# Altium schematic sheet LO 1.SchDoc
size A3; SheetNumber: 9; SheetTotal: 12
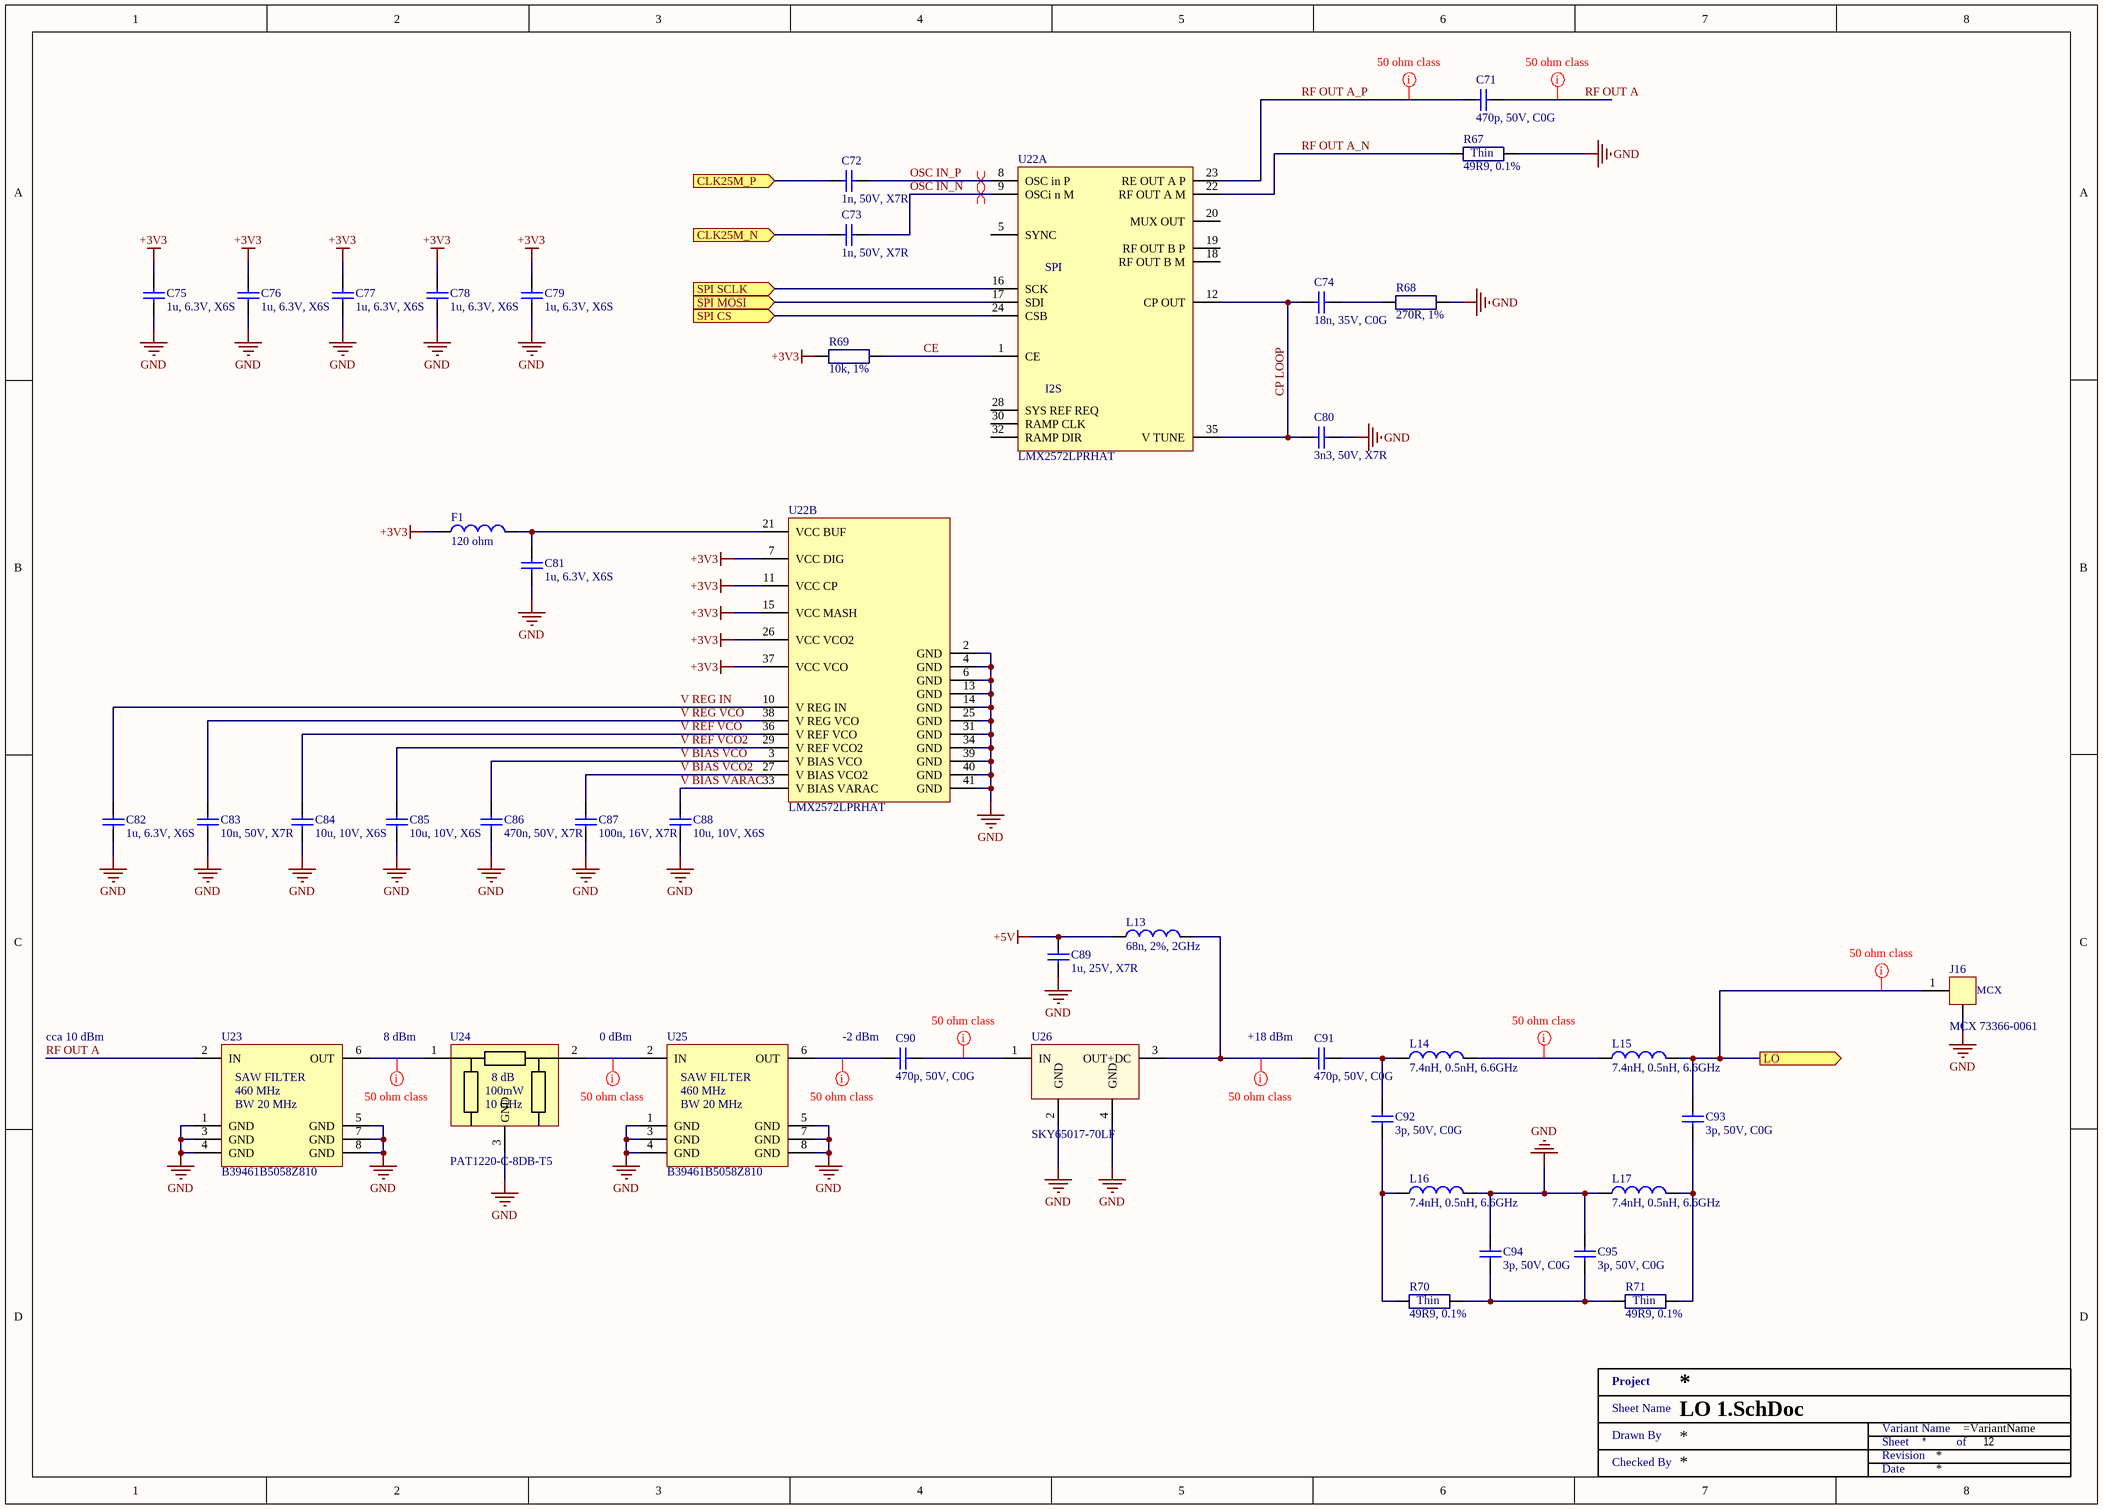
[diagram p0: LO 1.SchDoc]

## Parts
C71  470p, 50V, C0G  [SMD0603]
C72  1n, 50V, X7R  [SMD0402]
C73  1n, 50V, X7R  [SMD0402]
C74  18n, 35V, C0G  [SMD0603]
C75  1u, 6.3V, X6S  [SMD0402]
C76  1u, 6.3V, X6S  [SMD0402]
C77  1u, 6.3V, X6S  [SMD0402]
C78  1u, 6.3V, X6S  [SMD0402]
C79  1u, 6.3V, X6S  [SMD0402]
C80  3n3, 50V, X7R  [SMD0603]
C81  1u, 6.3V, X6S  [SMD0402]
C82  1u, 6.3V, X6S  [SMD0402]
C83  10n, 50V, X7R  [SMD0402]
C84  10u, 10V, X6S  [SMD0603]
C85  10u, 10V, X6S  [SMD0603]
C86  470n, 50V, X7R  [SMD0603]
C87  100n, 16V, X7R  [SMD0402]
C88  10u, 10V, X6S  [SMD0603]
C89  1u, 25V, X7R  [SMD0603]
C90  470p, 50V, C0G  [SMD0603]
C91  470p, 50V, C0G  [SMD0603]
C92  3p, 50V, C0G  [SMD0402]
C93  3p, 50V, C0G  [SMD0402]
C94  3p, 50V, C0G  [SMD0402]
C95  3p, 50V, C0G  [SMD0402]
F1  120 ohm  [SMD0805 - R]
J16  MCX 73366-0061  [73366-0061]
L13  68n, 2%, 2GHz  [SMD0603 - L]
L14  7.4nH, 0.5nH, 6.6GHz  [Coilcraft-0402DC]
L15  7.4nH, 0.5nH, 6.6GHz  [Coilcraft-0402DC]
L16  7.4nH, 0.5nH, 6.6GHz  [Coilcraft-0402DC]
L17  7.4nH, 0.5nH, 6.6GHz  [Coilcraft-0402DC]
R67  49R9, 0.1%  [SMD0402 - R]
R68  270R, 1%  [SMD0603 - R]
R69  10k, 1%  [SMD0603 - R]
R70  49R9, 0.1%  [SMD0402 - R]
R71  49R9, 0.1%  [SMD0402 - R]
U22  LMX2572LPRHAT  [VQFN50P600X600X100_HS-41N]  (parts A,B of 2)
U23  B39461B5058Z810  [QCC8B]
U24  PAT1220-C-8DB-T5  [PAT1220]
U25  B39461B5058Z810  [QCC8B]
U26  SKY65017-70LF  [SOT89]
XX?  Title 1  (value not drawn)  (graphical)

## Ports
CLK25M_N (in), CLK25M_P (in), LO (out), SPI CS (in), SPI MOSI (in), SPI SCLK (in)

## Nets
+3V3: C75.2 C76.2 C77.2 C78.2 C79.2 F1.1 R69.2 U22.7(VCC_DIG) U22.11(VCC_CP) U22.15(VCC_MASH) U22.26(VCC_VCO2) U22.37(VCC_VCO)
+5V: C89.2 L13.1
GND: C75.1 C76.1 C77.1 C78.1 C79.1 C80.1 C81.1 C82.1 C83.1 C84.1 C85.1 C86.1 C87.1 C88.1 C89.1 C94.2 C95.2 J16.2(GND) L16.2 L17.1 R67.2 R68.1 U22.2(GND) U22.4(GND) U22.6(GND) U22.13(GND) U22.14(GND) U22.25(GND) U22.31(GND) U22.34(GND) U22.39(GND) U22.40(GND) U22.41(GND) U23.1(GND) U23.3(GND) U23.4(GND) U23.5(GND) U23.7(GND) U23.8(GND) U24.3(GND) U25.1(GND) U25.3(GND) U25.4(GND) U25.5(GND) U25.7(GND) U25.8(GND) U26.2(GND) U26.4(GND)
CE: R69.1 U22.1(CE)
CLK25M_N: C73.1 ; port CLK25M_N
CLK25M_P: C72.1 ; port CLK25M_P
CP LOOP: C74.1 C80.2 U22.12(CP_OUT) U22.35(V_TUNE)
LO: C93.2 J16.1(INPUT) L15.2 ; port LO
OSC IN_N: C73.2 U22.9(OSCi_n_M)
OSC IN_P: C72.2 U22.8(OSC_in_P)
RF OUT A: C71.2 U23.2(IN)
RF OUT A_N: R67.1 U22.22(RF_OUT_A_M)
RF OUT A_P: C71.1 U22.23(RE_OUT_A_P)
SPI CS: U22.24(CSB) ; port SPI CS
SPI MOSI: U22.17(SDI) ; port SPI MOSI
SPI SCLK: U22.16(SCK) ; port SPI SCLK
V BIAS VARAC: C88.2 U22.33(V_BIAS_VARAC)
V BIAS VCO: C86.2 U22.3(V_BIAS_VCO)
V BIAS VCO2: C87.2 U22.27(V_BIAS_VCO2)
V REF VCO: C84.2 U22.36(V_REF_VCO)
V REF VCO2: C85.2 U22.29(V_REF_VCO2)
V REG IN: C82.2 U22.10(V_REG_IN)
V REG VCO: C83.2 U22.38(V_REG_VCO)
NetC74_2: C74.2 R68.2
NetC81_2: C81.2 F1.2 U22.21(VCC_BUF)
NetC90_1: C90.1 U25.6(OUT)
NetC90_2: C90.2 U26.1(IN)
NetC91_1: C91.1 L13.2 U26.3(OUT+DC)
NetC91_2: C91.2 C92.2 L14.1
NetC92_1: C92.1 L16.1 R70.1
NetC93_1: C93.1 L17.2 R71.2
NetC94_1: C94.1 C95.1 R70.2 R71.1
NetL14_2: L14.2 L15.1
NetU23_6: U23.6(OUT) U24.1
NetU24_2: U24.2 U25.2(IN)

Not connected (* = marked no-connect by the designer): U22 5(SYNC) 18(RF_OUT_B_M) 19(RF_OUT_B_P) 20(MUX_OUT) 28(SYS_REF_REQ) 30(RAMP_CLK) 32(RAMP_DIR)

## Layout directives
differential pair: OSC IN_N, OSC IN_P
net class 50 ohm: LO, NetC90_1, NetC90_2, NetC91_1, NetL14_2, NetU23_6, NetU24_2, RF OUT A, RF OUT A_P

## Notes on the sheet
- cca 10 dBm
- 8 dBm
- 0 dBm
- (near C90) -2 dBm
- (near C91) +18 dBm
- (in symbol AT0402BRD0749R9L) Thin
- (in symbol B39461B5058Z810) SAW FILTER; 460 MHz; BW 20 MHz
- (in symbol LMX2572LPRHAT, part A) SPI; I2S
- (in symbol PAT1220-C-8DB-T5) 8 dB; 10 GHz
- (in symbol Title 1) Project; Sheet Name; Variant Name; Drawn By; Sheet; of; Revision; Checked By; Date

## Library data of the parts
C71 C90 C91 = GCM1885C1H471JA16D: MURATA - GCM1885C1H471JA16D - CAP, MLCC, C0G/NP0, 470PF, 50V, 0603; Ceramic Capacitor Case: 0603 [1608 Metric]; Voltage Rating: 50; Capacitance Tolerance: ± 5%; Product Range: GCM Series; SVHC: No SVHC (17-Dec-2015)<!--FANDB--><div class="features-and-benefits-container"><div class="features-and-benefits-desc-container"><span class="features-and-benefits-container-desc">SMD Multilayer Ceramic Capacitor, 0603 [1608 Metric], 470 pF, 50 V, ± 5%, C0G / NP0, GCM Series</span></div><div class="features-and-benefits-description"><span class="features-benefits-value">The GCM series capacitors from Murata are automotive grade multilayer ceramic chip capacitors (MLCC) used for automotive applications such as power train and safety equipment. The safety equipment includes drive system control, air bags and ABS of engine ECU. These MLCC capacitors are classified into temperature compensating and high dielectric constant types depending on the change in electrostatic capacitance due to change in temperature. The temperature compensating capacitors feature a small rate of change in electrostatic capacitance as the temperature changes. The high dielectric constant capacitors use materials with a high dielectric constant and feature a large electrostatic capacitance.</span></div><div class="features-and-benefits-list"><ul class="features-and-benefits-list-list"><li class="features-and-benefits-list-item">Capacitance values ranges from 0.1pF to 47?F</li><li class="features-and-benefits-list-item">Large capacity and small size in a multilayer structure</li><li class="features-and-benefits-list-item">Tin plated external electrodes, excellent solderability</li><li class="features-and-benefits-list-item">Capacitor size varies from 0.6mm x 0.3mm to 5.7mm x 5.0mm</li><li class="features-and-benefits-list-item">Voltage rating ranges from 6.3VDC to 1000VDC</li><li class="features-and-benefits-list-item">Temperature characteristics are classified according to JIS and EIA standard</li><li class="features-and-benefits-list-item">Operating temperature changes according to temperature coefficient of capacitor</li><li class="features-and-benefits-list-item">Automotive grade AEC-Q200 qualified</li></ul></div><div class="features-and-benefits-applications"><ul class="features-and-benefits-value"><li class="features-and-benefits-list-item">Industrial</li><li class="features-and-benefits-list-item">Consumer Electronics</li><li class="features-and-benefits-list-item">Portable Devices</li><li class="features-and-benefits-list-item">Power Management</li><li class="features-and-benefits-list-item">Safety</li><li class="features-and-benefits-list-item">Automotive</li></ul></div></div>; Supplier 1: Farnell; Supplier Part Number 1: 2494192; Manufacturer: MURATA; Manufacturer Part Number: GCM1885C1H471JA16D; RoHS: YES; Stock 1: 10240; Pricing 1: 10=0.0277, 100=0.0184, 500=0.0139, 1000=0.0111, 2000=0.0103, 4000=0.0091, 20000=0.0077, 40000=0.0071 (GBP); Capacitance: 470p; Dielectric Characteristic: C0G / NP0; Packaging: Cut Tape; Operating Temperature Min: -55; Operating Temperature Max: 125; Automotive Qualification Standard: -; MSL: MSL 6 - Time on Label; ComponentLink1URL: http://www.farnell.com/datasheets/1955642.pdf; ComponentLink1Description: http://www.farnell.com/datasheets/1955642.pdf; Supplier 2: Digi-Key; Supplier Part Number 2: 490-4965-1-ND
C72 C73 = MC0402B102K500CT: MULTICOMP - MC0402B102K500CT - CAP, MLCC, X7R, 1NF, 50V, 0402; Ceramic Capacitor Case: 0402 [1005 Metric]; Voltage Rating: 50; Capacitance Tolerance: ± 10%; Dielectric Characteristic: X7; Product Range: MC Series; SVHC: No SVHC (07-Jul-2017); Capacitor Terminals: SMD; External Depth: 1; External Length / Height: 0.5; No. of Pins: 2; Supplier 1: Farnell; Supplier Part Number 1: 1758991; Manufacturer: MULTICOMP; Manufacturer Part Number: MC0402B102K500CT; RoHS: YES; Stock 1: 83283; Pricing 1: 10=0,0036, 100=0,0032, 500=0,0029, 2500=0,0021, 5000=0,0018 (GBP); Capacitance: 1n; Packaging: Cut Tape; Operating Temperature Min: -55; Operating Temperature Max: 125; Automotive Qualification Standard: -; MSL: -; Capacitance Tolerance ±: ± 10%; External Width: 0.5; Operating Temperature Range: -55°C to +125°C<!--FANDB--><div class="features-and-benefits-container"><div class="features-and-benefits-desc-container"><span class="features-and-benefits-container-desc">SMD Multilayer Ceramic Capacitor, 0402 [1005 Metric], 1000 pF, 50 V, ± 10%, X7R, MC Series</span></div><div class="features-and-benefits-description"><span class="features-benefits-value">The Multicomp MC series is general purpose MLCC capacitors with X7R dielectric material which provides high electrical precision, stability and reliability. This MLCC capacitor consists of a conducting material and electrodes with high density and high efficiency ceramic condensers.</span></div><div class="features-and-benefits-list"><ul class="features-and-benefits-list-list"><li class="features-and-benefits-list-item">Small size with higher capacitance values</li><li class="features-and-benefits-list-item">0201, 0402, 0603, 0805, 1206, 1210, 1812 case sizes available</li><li class="features-and-benefits-list-item">Capacitance value ranging from 100pF to 47?F</li><li class="features-and-benefits-list-item">Capacitor with lead free termination (pure Tin)</li><li class="features-and-benefits-list-item">High electrical precision, stability and reliability</li><li class="features-and-benefits-list-item">Rated voltage of 6.3V, 10V, 16V, 25V, 50V, 100V</li><li class="features-and-benefits-list-item">Operating temperature of -55°C to +125°C</li><li class="features-and-benefits-list-item">Available in ±5%, ±10% and ±20; ComponentLink1URL: http://www.farnell.com/datasheets/1901289.pdf; ComponentLink1Description: http://www.farnell.com/datasheets/1901289.pdf
C74 = C1608C0G1V183J080AC: Cap Ceramic 0.018uF 35V C0G 5% Pad SMD 0603 125C T/R; Manufacturer: TDK; Supplier 1: Mouser; Supplier Part Number 1: 810-C1608C0G1V183JAC; Manufacturer Part Number: C1608C0G1V183J080AC; RoHS: Yes; Category: Ceramic Capacitors; Stock 1: 3185; Pricing 1: 1=0.37000, 10=0.16800, 50=0.16800, 100=0.14300, 1000=0.08800, 10000=0.06600 (USD); Mount: Surface Mount; Case/Package: 0603; Case Code (Metric): 1608; Case Code (Imperial): 0603; Dielectric Material: Ceramic; Min Operating Temperature: -55°C; Max Operating Temperature: 125°C; Packaging: Tape and Reel; Capacitance: 18n; Voltage Rating: 35V; Tolerance: 5%; Voltage Rating (DC): 35V; Length: 0.063inch; Width: 0.031inch; Thickness: 0.035inch; Lead Free: Lead Free; RoHS Compliant: Yes; ComponentLink1URL: https://product.tdk.com/info/en/catalog/spec/mlccspec_commercial_general_midvoltage_en.pdf?src-supplier=Digi-Key; ComponentLink1Description: https://product.tdk.com/info/en/catalog/spec/mlccspec_commercial_general_midvoltage_en.pdf?src-supplier=Digi-Key; Supplier 2: Farnell; Supplier Part Number 2: 3416084; Supplier 3: Digi-Key; Supplier Part Number 3: 445-174558-1-ND; Supplier 4: Newark; Supplier Part Number 4: 71AH3230
C75-C79 C81 C82 = GRT155C80J105KE01D: MURATA - GRT155C80J105KE01D - CAP, MLCC, AECQ200, X6S, 1UF, 6.3V, 0402; Ceramic Capacitor Case: 0402 [1005 Metric]; Voltage Rating: 6.3; Capacitance Tolerance: ± 10%; Dielectric Characteristic: X6; Product Range: GRT Series; Automotive Qualification Standard: AEC-Q200; SVHC: No SVHC (20-Jun-2016)<!--FANDB--><div class="features-and-benefits-container"><div class="features-and-benefits-description"><span class="features-benefits-value">The GRT155C80J105KE01D from Murata is a GRT series AEC-Q200 automotive-grade monolithic ceramic capacitor. This capacitor meets the AEC-Q200 reliability test standard requirements established by the Automotive Electronics Council. GRT series MLCC capacitors are classified into temperature compensating and high dielectric constant types depending on the change in electrostatic capacitance due to change in temperature. The temperature compensating capacitors feature a small rate of change in electrostatic capacitance as the temperature changes and are used for applications such as filters and high frequency circuit matching. The high dielectric constant capacitors use materials with a high dielectric constant and feature a large electrostatic capacitance. It is designed for use in car multimedia, car interior, car comfort application and general electronic equipment. It is not appropriate for use in applications critical to passenger safety and car driving function (ABS, AIRBAG etc).</span></div><div class="features-and-benefits-list"><ul class="features-and-benefits-list-list"><li class="features-and-benefits-list-item">AEC-Q200 automotive grade qualified</li><li class="features-and-benefits-list-item">Tin plated external electrodes, excellent solderability</li><li class="features-and-benefits-list-item">Capacitance value is 1µF</li><li class="features-and-benefits-list-item">Capacitance tolerance is ±10%</li><li class="features-and-benefits-list-item">Capacitor case size is 0402 [1005 Metric]</li><li class="features-and-benefits-list-item">X6S dielectric material</li><li class="features-and-benefits-list-item">Operating temperature range from -55°C to 105°C</li><li class="features-and-benefits-list-item">Voltage rating is 6.3; Supplier 1: Farnell; Supplier Part Number 1: 2672103; Manufacturer: MURATA; Manufacturer Part Number: GRT155C80J105KE01D; RoHS: YES; Stock 1: 19999; Pricing 1: 10=0,0194, 100=0,0149, 500=0,0108, 2500=0,0079, 5000=0,0069, 10000=0,0062, 50000=0,0048, 100000=0,0047 (GBP); Capacitance: 1u; Packaging: Cut Tape; Operating Temperature Min: -55; Operating Temperature Max: 105; MSL: MSL 1 - Unlimited; ComponentLink1URL: http://www.farnell.com/datasheets/2165909.pdf; ComponentLink1Description: http://www.farnell.com/datasheets/2165909.pdf
C80 = 0603B332K500CT: WALSIN - 0603B332K500CT - CAPACITOR, MLCC, X7R, 3300PF, 50V, 0603; Ceramic Capacitor Case: 0603 [1608 Metric]; Voltage Rating: 50; Capacitance Tolerance: ± 10%; Dielectric Characteristic: X7; Supplier 1: Farnell; Supplier Part Number 1: 2496853; Manufacturer: WALSIN; Manufacturer Part Number: 0603B332K500CT; RoHS: YES; Stock 1: 10797; Pricing 1: 10=0,0068, 100=0,0053, 500=0,0038, 1000=0,0031, 2000=0,0027 (GBP); Capacitance: 3n3; Product Range: -; Packaging: Cut Tape; Operating Temperature Min: -55; Operating Temperature Max: 125; Automotive Qualification Standard: -; MSL: MSL 1 - Unlimited<!--FANDB--><div class="features-and-benefits-container"><div class="features-and-benefits-desc-container"><span class="features-and-benefits-container-desc">SMD Multilayer Ceramic Capacitor, 0603 [1608 Metric], 3300 pF, 50 V, ± 10%, X7R</span></div><div class="features-and-benefits-description"><span class="features-benefits-value">The general purpose series capacitors from Walsin are X7R dielectric multilayer ceramic chip capacitors (MLCC) that provides high electrical precision, stability and reliability. These MLCC capacitors consist of a conducting material and electrodes. The high density and high efficiency ceramic condensers are used to manufacture chip type miniaturized MLCC capacitors.</span></div><div class="features-and-benefits-list"><ul class="features-and-benefits-list-list"><li class="features-and-benefits-list-item">Capacitance values ranges from 100pF to 47?F</li><li class="features-and-benefits-list-item">EIA 0201, 0402, 0603, 0805, 1206, 1210, 1812 case sizes available</li><li class="features-and-benefits-list-item">Available voltage ratings are 6.3V, 10V, 16V, 25V, 35V, 50V, 100V</li><li class="features-and-benefits-list-item">Operating temperature range from -55°C to 125°C</li><li class="features-and-benefits-list-item">Available in ±5%, ±10%, ±20; ComponentLink1URL: http://www.farnell.com/datasheets/2340522.pdf; ComponentLink1Description: http://www.farnell.com/datasheets/2340522.pdf; Supplier 2: Digi-Key; Supplier Part Number 2: BC1249TR-ND
C83 = MC0402B103K500CT: MULTICOMP - MC0402B103K500CT - CAP, MLCC, X7R, 0.01UF, 50V, 0402; Ceramic Capacitor Case: 0402 [1005 Metric]; Voltage Rating: 50; Capacitance Tolerance: ± 10%; Dielectric Characteristic: X7; Product Range: MC Series; SVHC: No SVHC (12-Jan-2017)<!--FANDB--><div class="features-and-benefits-container"><div class="features-and-benefits-desc-container"><span class="features-and-benefits-container-desc">SMD Multilayer Ceramic Capacitor, 0402 [1005 Metric], 0.01 µF, 50 V, ± 10%, X7R, MC Series</span></div><div class="features-and-benefits-description"><span class="features-benefits-value">The Multicomp MC series are general purpose MLCC (Multilayer Ceramic Capacitor) capacitors with X7R dielectric material which provides high electrical precision, stability and reliability. These MLCC capacitors consists of a conducting material and electrodes with high density and high efficiency ceramic condensers.</span></div><div class="features-and-benefits-list"><ul class="features-and-benefits-list-list"><li class="features-and-benefits-list-item">Small size with higher capacitance values</li><li class="features-and-benefits-list-item">0201, 0402, 0603, 0805, 1206, 1210, 1812 case sizes available</li><li class="features-and-benefits-list-item">Capacitance value ranging from 100pF to 47?F</li><li class="features-and-benefits-list-item">Cu/Ni/Sn termination</li><li class="features-and-benefits-list-item">High electrical precision, stability and reliability</li><li class="features-and-benefits-list-item">Available in 6.3V, 10V, 16V, 25V, 50V and 100V rated voltages</li><li class="features-and-benefits-list-item">Operating temperature of -55°C to +125°C</li><li class="features-and-benefits-list-item">Available in ±5%, ±10% and ±20% tolerances</li><li class="features-and-benefits-list-item">Capacitance characteristic of ±15; Supplier 1: Farnell; Supplier Part Number 1: 2627340; Manufacturer: MULTICOMP; Manufacturer Part Number: MC0402B103K500CT; RoHS: YES; Stock 1: 29387; Pricing 1: 10=0,0043, 100=0,0039, 500=0,0035, 2500=0,0021, 5000=0,0017 (GBP); Capacitance: 10n; Packaging: Cut Tape; Operating Temperature Min: -55; Operating Temperature Max: 125; Automotive Qualification Standard: -; MSL: MSL 1 - Unlimited; ComponentLink1URL: http://www.farnell.com/datasheets/2117933.pdf; ComponentLink1Description: http://www.farnell.com/datasheets/2117933.pdf
C84 C85 C88 = GRT188C81A106ME13D: Cap Ceramic 10uF 10V X6S 20% Pad SMD 0603 105C Automotive T/R; Manufacturer: Murata; Supplier 1: Mouser; Supplier Part Number 1: 81-GRT188C81A106ME3D; Manufacturer Part Number: GRT188C81A106ME13D; RoHS: No; Category: Ceramic Capacitors; Stock 1: 1862; Pricing 1: 1=0.41000, 10=0.20100, 50=0.20100, 100=0.17200, 1000=0.10900, 10000=0.09700 (USD); Mount: Surface Mount; Case/Package: 0603; Case Code (Metric): 1608; Case Code (Imperial): 0603; Min Operating Temperature: -55°C; Max Operating Temperature: 105°C; Packaging: Tape and Reel; Capacitance: 10uF; Voltage Rating: 10V; Tolerance: 20%; Length: 0.063inch; Width: 0.031inch; Thickness: 0.035inch; Ratings: AEC-Q200; ComponentLink1URL: http://search.murata.co.jp/Ceramy/image/img/A01X/G101/ENG/GRT188C81A106ME13-01.pdf?src-supplier=Digi-Key; ComponentLink1Description: http://search.murata.co.jp/Ceramy/image/img/A01X/G101/ENG/GRT188C81A106ME13-01.pdf?src-supplier=Digi-Key; Supplier 2: Farnell; Supplier Part Number 2: 3582904; Supplier 3: Digi-Key; Supplier Part Number 3: 490-12283-6-ND
C86 = C1608X7R1H474K080AC: TDK - C1608X7R1H474K080AC - SMD Multilayer Ceramic Capacitor, 0.47 µF, 50 V, 0603 [1608 Metric], ± 10%, X7R, C Series TDK; Supplier 1: Mouser; Supplier Part Number 1: 810-C1608X7R1H474K; Manufacturer: TDK; Manufacturer Part Number: C1608X7R1H474K080AC; RoHS: Yes; Category: Ceramic Capacitors; Stock 1: 163800; Pricing 1: 1=0,28000, 10=0,14200, 100=0,09100, 500=0,07500, 1000=0,06100, 4000=0,04900 (USD); Mount: Surface Mount; Case/Package: 0603; Weight: 7.1E-05oz; Dielectric Material: Ceramic; Case Code (Metric): 1608; Case Code (Imperial): 0603; Min Operating Temperature: -55°C; Max Operating Temperature: 125°C; Dielectric: X7R; Capacitance: 470n; Tolerance: 10%; Voltage Rating (DC): 50V; Termination: SMD/SMT; Voltage Rating: 50V; Packaging: Tape and Reel; Composition: Ceramic; Package Quantity: 4000; Voltage: 50V; Length: 1.6mm; Height: 0.8mm; Depth: 0.8mm; Width: 0.031inch; Thickness: 0.037inch; Radiation Hardening: No; Lead Free: Lead Free; REACH SVHC: No SVHC; ComponentLink1URL: https://datasheet.ciiva.com/28693/1735394-28693461.pdf?src-supplier=Element14; ComponentLink1Description: https://datasheet.ciiva.com/28693/1735394-28693461.pdf?src-supplier=Element14; ComponentLink2URL: https://datasheet.ciiva.com/6290/tdkmlcccaprange-6290870.pdf?src-supplier=Digi-Key; ComponentLink2Description: https://datasheet.ciiva.com/6290/tdkmlcccaprange-6290870.pdf?src-supplier=Digi-Key; ComponentLink3URL: https://datasheet.ciiva.com/22718/1904212-22718022.pdf?src-supplier=Element14; ComponentLink3Description: https://datasheet.ciiva.com/22718/1904212-22718022.pdf?src-supplier=Element14; ComponentLink4URL: https://datasheet.ciiva.com/28451/1904212-28451367.pdf?src-supplier=Element14; ComponentLink4Description: https://datasheet.ciiva.com/28451/1904212-28451367.pdf?src-supplier=Element14; ComponentLink5URL: https://datasheet.ciiva.com/6290/tdkmlcccaprange-6290878.pdf?src-supplier=Digi-Key; ComponentLink5Description: https://datasheet.ciiva.com/6290/tdkmlcccaprange-6290878.pdf?src-supplier=Digi-Key; ComponentLink6URL: https://datasheet.ciiva.com/6290/tdkmlcccaprange-6290874.pdf?src-supplier=Digi-Key; ComponentLink6Description: https://datasheet.ciiva.com/6290/tdkmlcccaprange-6290874.pdf?src-supplier=Digi-Key; ComponentLink7URL: https://datasheet.ciiva.com/17487/e412-c-17487386.pdf?src-supplier=Avnet+Europe; ComponentLink7Description: https://datasheet.ciiva.com/17487/e412-c-17487386.pdf?src-supplier=Avnet+Europe; ComponentLink8URL: https://datasheet.ciiva.com/16427/e412-c-16427759.pdf?src-supplier=Future+Electronics; ComponentLink8Description: https://datasheet.ciiva.com/16427/e412-c-16427759.pdf?src-supplier=Future+Electronics; Supplier 2: Farnell; Supplier Part Number 2: 2522012; Supplier 3: Digi-Key; Supplier Part Number 3: 445-5952-1-ND
C87 = MC0402B104K160CT: MULTICOMP - MC0402B104K160CT - CAP, MLCC, X7R, 100NF, 16V, 0402; Ceramic Capacitor Case: 0402 [1005 Metric]; Voltage Rating: 16; Capacitance Tolerance: ± 10%; Dielectric Characteristic: X7; Product Range: MC Series; SVHC: No SVHC (07-Jul-2017); Capacitor Terminals: SMD; External Depth: 1; External Length / Height: 0.5; No. of Pins: 2; Supplier 1: Farnell; Supplier Part Number 1: 1758896; Manufacturer: MULTICOMP; Manufacturer Part Number: MC0402B104K160CT; RoHS: YES; Stock 1: 315490; Pricing 1: 10=0,0043, 100=0,0039, 500=0,0035, 2500=0,0021, 5000=0,0017 (GBP); Capacitance: 100n; Packaging: Cut Tape; Operating Temperature Min: -55; Operating Temperature Max: 125; Automotive Qualification Standard: -; MSL: -; Capacitance Tolerance ±: ± 10%; External Width: 0.5; Operating Temperature Range: -55°C to +125°C<!--FANDB--><div class="features-and-benefits-container"><div class="features-and-benefits-desc-container"><span class="features-and-benefits-container-desc">SMD Multilayer Ceramic Capacitor, 0402 [1005 Metric], 0.1 µF, 16 V, ± 10%, X7R, MC Series</span></div><div class="features-and-benefits-description"><span class="features-benefits-value">The Multicomp MC series is general purpose MLCC capacitors with X7R dielectric material which provides high electrical precision, stability and reliability. This MLCC capacitor consists of a conducting material and electrodes with high density and high efficiency ceramic condensers.</span></div><div class="features-and-benefits-list"><ul class="features-and-benefits-list-list"><li class="features-and-benefits-list-item">Small size with higher capacitance values</li><li class="features-and-benefits-list-item">0201, 0402, 0603, 0805, 1206, 1210, 1812 case sizes available</li><li class="features-and-benefits-list-item">Capacitance value ranging from 100pF to 47?F</li><li class="features-and-benefits-list-item">Capacitor with lead free termination (pure Tin)</li><li class="features-and-benefits-list-item">High electrical precision, stability and reliability</li><li class="features-and-benefits-list-item">Rated voltage of 6.3V, 10V, 16V, 25V, 50V, 100V</li><li class="features-and-benefits-list-item">Operating temperature of -55°C to +125°C</li><li class="features-and-benefits-list-item">Available in ±5%, ±10% and ±20; ComponentLink1URL: http://www.farnell.com/datasheets/1901289.pdf; ComponentLink1Description: http://www.farnell.com/datasheets/1901289.pdf
C89 = CGA3E1X7R1E105K080AC: CAP CER 1UF 25V X7R 0603; Manufacturer: TDK Corporation; Tolerance: ±10%; Manufacturer Part Number: CGA3E1X7R1E105K080AC; RoHS: RoHS Compliant; Category: Capacitors; Stock 1: 109509; Pricing 1: 1=0.2, 10=0.135, 100=0.0686, 500=0.04696, 1000=0.04154 (USD); Packaging: Cut Tape (CT); Part Status: Active; Voltage - Rated: 25V; Temperature Coefficient: X7R; Operating Temperature: -55°C ~ 125°C; Features: -; Ratings: AEC-Q200; Applications: Automotive; Failure Rate: -; Mounting Type: Surface Mount, MLCC; Package / Case: 0603 (1608 Metric); Size / Dimension: 0.063" L x 0.032" W (1.60mm x 0.80mm); Height - Seated (Max): -; Thickness (Max): 0.035" (0.90mm); Lead Spacing: -; Lead Style: -; ComponentLink1URL: https://product.tdk.com/info/en/catalog/datasheets/mlcc_automotive_general_en.pdf; ComponentLink1Description: https://product.tdk.com/info/en/catalog/datasheets/mlcc_automotive_general_en.pdf; Capacitance: 1u; Supplier 1: Mouser; Supplier Part Number 1: 810-CGA3E1X7R1E105K; Supplier 2: Farnell; Supplier Part Number 2: 2346962; Supplier 3: Digi-Key; Supplier Part Number 3: 445-6931-1-ND
C92-C95 = GJM1555C1H3R0WB01D: CAP CER 3PF 50V C0G/NP0 0402; Manufacturer: Murata; Supplier 1: Mouser; Supplier Part Number 1: 81-GJM1555C1H3R0WB1D; Manufacturer Part Number: GJM1555C1H3R0WB01D; RoHS: Yes; Category: Ceramic Capacitors; Stock 1: 79370; Pricing 1: 1=0.27000, 10=0.18500, 50=0.18500, 100=0.10500, 500=0.07400, 1000=0.06500, 2500=0.06200, 5000=0.05700, 10000=0.04700 (USD); Mount: Surface Mount; Case/Package: 0402; Case Code (Imperial): 0402; Case Code (Metric): 1005; Min Operating Temperature: -55°C; Max Operating Temperature: 125°C; Capacitance: 3pF; Package Quantity: 10000; Packaging: Tape and Reel; Voltage Rating: 50V; Dielectric: C0G; Voltage Rating (DC): 50V; Termination: SMD/SMT; Series: GJM; Construction: Flat; Length: 1mm; Width: 0.5mm; Height: 0.5mm; Thickness: 0.022inch; Depth: 0.5mm; Radiation Hardening: No; RoHS Compliant: Yes; ComponentLink1URL: http://www.mouser.com/ds/2/281/c02e-2905.pdf?src-supplier=Mouser; ComponentLink1Description: http://www.mouser.com/ds/2/281/c02e-2905.pdf?src-supplier=Mouser; ComponentLink2URL: http://search.murata.co.jp/Ceramy/image/img/PDF/ENG/GJM1555C1H3R0WB01.pdf?src-supplier=Avnet; ComponentLink2Description: http://search.murata.co.jp/Ceramy/image/img/PDF/ENG/GJM1555C1H3R0WB01.pdf?src-supplier=Avnet; ComponentLink3URL: http://search.murata.co.jp/Ceramy/image/img/A01X/G101/ENG/GJM1555C1H3R0WB01-01.pdf?src-supplier=Digi-Key; ComponentLink3Description: http://search.murata.co.jp/Ceramy/image/img/A01X/G101/ENG/GJM1555C1H3R0WB01-01.pdf?src-supplier=Digi-Key; ComponentLink4URL: http://search.murata.co.jp/Ceramy/image/img/A01X/partnumbering_e_01.pdf?src-supplier=Digi-Key; ComponentLink4Description: http://search.murata.co.jp/Ceramy/image/img/A01X/partnumbering_e_01.pdf?src-supplier=Digi-Key; ComponentLink5URL: http://components.arrow.com/part/dataview/46522145S277297N2606?src-supplier=Arrow+Electronics; ComponentLink5Description: http://components.arrow.com/part/dataview/46522145S277297N2606?src-supplier=Arrow+Electronics; Supplier 2: Farnell; Supplier Part Number 2: 3243232; Supplier 3: Digi-Key; Supplier Part Number 3: 490-11211-1-ND; Supplier 4: RSComponents; Supplier Part Number 4: 1853162
F1 = 742792023: WURTH ELEKTRONIK - 742792023 - FERRITE BEAD, 0.03OHM, 3A, 0805; Impedance @ 100MHz: 120; Ferrite Case Style: 0805 [2012 Metric]; DC Current Rating: 3; DC Resistance Max: 0.03; Impedance Tolerance: ± 25%; Ferrite Mounting: SMD; Resistance: 0.03ohm<!--FANDB--><div class="features-and-benefits-container"><div class="features-and-benefits-description"><span class="features-benefits-value">The 742792023 is a SMD EMI Suppression Ferrite Bead with 0805 case and reliable Ni-Sn electrodes. It can be put directly on the printed circuit board. It offers excellent anti-EMI properties and low DC resistance. Placed very close next to the interference source even with smallest size 0402, maximal impedance at 1000; Manufacturer: WURTH ELEKTRONIK; Manufacturer Part Number: 742792023; RoHS: YES; Stock 1: 4283; Pricing 1: 1=0,123, 50=0,112, 100=0,103, 500=0,0937, 1000=0,0877, 2000=0,0846 (GBP); Product Range: -; Automotive Qualification Standard: -; Packaging: Cut Tape; ComponentLink1URL: http://www.farnell.com/datasheets/1695980.pdf; ComponentLink1Description: http://www.farnell.com/datasheets/1695980.pdf; ComponentLink2URL: http://www.farnell.com/cad/1670054.zip; ComponentLink2Description: http://www.farnell.com/cad/1670054.zip; Supplier 1: Mouser; Supplier Part Number 1: 710-742792023; Supplier 2: Farnell; Supplier Part Number 2: 1635732; Supplier 3: Digi-Key; Supplier Part Number 3: 732-1613-1-ND
J16 = 73366-0061: CONN MCX JACK STR 50 OHM PCB; Manufacturer: Molex, LLC; Manufacturer Part Number: 0733660061; Connector Type: Jack, Female Socket; Contact Termination: Solder; Impedance: 50 Ohm; Body Material: Brass; Body Finish: Gold; Dielectric Material: Polytetrafluoroethylene (PTFE); Center Contact Material: Beryllium Copper; Mating Cycles: 500; RoHS: RoHS Compliant; Category: Connectors, Interconnects; Stock 1: 39394; Pricing 1: 1=1.95, 10=1.765, 25=1.6572, 50=1.5854, 100=1.5133, 250=1.36916, 500=1.26106, 1000=1.0809, 2500=1.00884 (USD); Packaging: Tray; Part Status: Active; Connector Style: MCX; Shield Termination: Solder; Mounting Type: Through Hole; Mounting Feature: -; Cable Group: -; Fastening Type: Snap-On; Features: -; Housing Color: Gold; Ingress Protection: -; Includes: -; Center Contact Plating: Gold; Operating Temperature: -55°C ~ 155°C; Insertion Loss: -; ComponentLink1URL: https://www.molex.com/pdm_docs/sd/733660061_sd.pdf; ComponentLink1Description: https://www.molex.com/pdm_docs/sd/733660061_sd.pdf; Supplier 1: Mouser; Supplier Part Number 1: 538-73366-0061; Supplier 2: Digi-Key; Supplier Part Number 2: WM5541-ND; Supplier 3: Farnell; Supplier Part Number 3: 1909245
L13 = 0603HP-68NXGLU: Fixed Inductors 0603HP Hi Perfrmnce 68 nH 2 % 0.6 A; Manufacturer: Coilcraft; Core Material: Ceramic; Q Factor: 49; Max DC Current: 600mA; DC Resistance (DCR): 330mR; Test Frequency: 200MHz; Supplier 1: Mouser; Supplier Part Number 1: 994-0603HP-68NXGLU; Manufacturer Part Number: 0603HP-68NXGLU; Stock 1: 2486; Pricing 1: 1=1.18000, 10=1.18000, 50=1.18000, 100=1.18000, 200=0.89000, 500=0.66000 (USD); RoHS: Yes; Mount: Surface Mount; Case/Package: 0603; Case Code (Metric): 1608; Case Code (Imperial): 0603; Min Operating Temperature: -40°C; Max Operating Temperature: 125°C; Packaging: Tape and Reel; Package Quantity: 100; Tolerance: 2%; Inductance: 68n; Self Resonant Frequency: 2GHz; Termination: SMD/SMT; Inductance Tolerance: 2%; Current Rating: 600mA; Length: 1.75mm; Height: 0.94mm; Width: 1.09mm; Lead Free: Contains Lead; REACH SVHC: No SVHC; ComponentLink1URL: https://datasheet.ciiva.com/22709/1681881-22709625.pdf?src-supplier=Element14; ComponentLink1Description: https://datasheet.ciiva.com/22709/1681881-22709625.pdf?src-supplier=Element14; Supplier 2: Farnell; Supplier Part Number 2: 2286163
L14-L17 = LQW15AN7N4D10D: Ind Chip Wirewound 7.4nH 0.5nH 0402 Paper T/R; Manufacturer: Murata; Supplier 1: Mouser; Supplier Part Number 1: 81-LQW15AN7N4D10D; Manufacturer Part Number: LQW15AN7N4D10D; Category: Fixed Inductors; Stock 1: 9490; Pricing 1: 1=0.21000, 10=0.17900, 50=0.17900, 100=0.11900, 1000=0.08300, 10000=0.05700 (USD); ComponentLink1URL: https://datasheet.octopart.com/LQW15AN7N4D10D-Murata-datasheet-138758294.pdf?src-supplier=Ciiva+Crawler; ComponentLink1Description: https://datasheet.octopart.com/LQW15AN7N4D10D-Murata-datasheet-138758294.pdf?src-supplier=Ciiva+Crawler; ComponentLink2URL: https://datasheet.octopart.com/LQW15AN7N4D10D-Murata-datasheet-140717249.pdf?src-supplier=Ciiva+Crawler; ComponentLink2Description: https://datasheet.octopart.com/LQW15AN7N4D10D-Murata-datasheet-140717249.pdf?src-supplier=Ciiva+Crawler; ComponentLink3URL: https://datasheet.octopart.com/LQW15AN7N4D10D-Murata-datasheet-141294512.pdf?src-supplier=Ciiva+Crawler; ComponentLink3Description: https://datasheet.octopart.com/LQW15AN7N4D10D-Murata-datasheet-141294512.pdf?src-supplier=Ciiva+Crawler; ComponentLink4URL: https://datasheet.octopart.com/LQW15AN7N4D10D-Murata-datasheet-142541909.pdf?src-supplier=Ciiva+Crawler; ComponentLink4Description: https://datasheet.octopart.com/LQW15AN7N4D10D-Murata-datasheet-142541909.pdf?src-supplier=Ciiva+Crawler; ComponentLink5URL: https://datasheet.octopart.com/LQW15AN7N4D10D-Murata-datasheet-140317909.pdf?src-supplier=Farnell; ComponentLink5Description: https://datasheet.octopart.com/LQW15AN7N4D10D-Murata-datasheet-140317909.pdf?src-supplier=Farnell; ComponentLink6URL: https://datasheet.octopart.com/LQW15AN7N4D10D-Murata-datasheet-145452064.pdf?src-supplier=Geoflip; ComponentLink6Description: https://datasheet.octopart.com/LQW15AN7N4D10D-Murata-datasheet-145452064.pdf?src-supplier=Geoflip; Supplier 2: Farnell; Supplier Part Number 2: 3356519; Supplier 3: Digi-Key; Supplier Part Number 3: 490-LQW15AN7N4D10DTR-ND
R67 R70 R71 = AT0402BRD0749R9L: Thin Film Resistors - SMD 49.9 Ohms 0.1% Tol. AEC-Q200; Manufacturer: Yageo; Power Rating: 62.5 mW (1/16 W); Temperature Coefficient: 25 PPM / C; Voltage Rating: 50 V; CNHTS: 8533211000; MXHTS: 85332101; TARIC: 8533210000; Supplier 1: Mouser; Supplier Part Number 1: 603-AT0402BRD0749R9L; Manufacturer Part Number: AT0402BRD0749R9L; RoHS: RoHS Compliant; Category: Thin Film Resistors - SMD; Stock 1: 9662; Pricing 1: 1=0.594, 10=0.346, 100=0.139, 1000=0.106, 2500=0.081, 10000=0.079, 20000=0.077 (EUR); Diameter: -; Features: -; Height: 0.3 mm; Length: 1 mm; Operating Temperature Range: - 55 C to + 125 C; Package / Case: 0402 (1005 metric); Packaging: Cut Tape; Product: Thin Film Resistors SMD; Resistance: 49.9 Ohms; Series: AT; Termination Style: SMD/SMT; Tolerance: 0.1 %; Type: High Precision High Stability Chip Resistors; Width: 0.5 mm; Brand: Yageo; Mounting Style: PCB Mount; Case Code - in: 0402; Case Code - mm: 1005; HTS Code: 8533210030; Maximum Operating Temperature: + 125 C; Minimum Operating Temperature: - 55 C; Product Type: Thin Film Resistors; Qualification: AEC-Q200; Standard Pack Qty: 10000; Subcategory: Resistors; RoHS - Mouser: Y; Minimum Order Quantity: 1; Reeling: True; ComponentLink1URL: http://www.mouser.com/datasheet/2/447/PYu-AT_51_RoHS_L_5-1222714.pdf; ComponentLink1Description: http://www.mouser.com/datasheet/2/447/PYu-AT_51_RoHS_L_5-1222714.pdf
R68 = WR06X2700FTL: WALSIN - WR06X2700FTL - RES, THICK FILM, 270R, 1%, 75V, 0603; Voltage Rating: 75; Resistor Case Style: 0603 [1608 Metric]; Power Rating: 100; Product Range: WR06 Series; Temperature Coefficient: ± 100; Supplier 1: Farnell; Supplier Part Number 1: 2502438; Manufacturer: WALSIN; Manufacturer Part Number: WR06X2700FTL; RoHS: YES; Stock 1: 6379; Pricing 1: 10=0.0132, 100=0.0044, 500=0.0027, 1000=0.0019, 2500=0.0014 (GBP); Resistance: 270R; Resistance Tolerance: ± 1%; Packaging: Cut Tape; Resistor Element Material: Thick Film; Automotive Qualification Standard: -; MSL: MSL 2 - 1 year<!--FANDB--><div class="features-and-benefits-container"><div class="features-and-benefits-desc-container"><span class="features-and-benefits-container-desc">SMD Chip Resistor, 270 ohm, 75 V, 0603 [1608 Metric], 100 mW, ± 1%, WR06 Series</span></div><div class="features-and-benefits-description"><span class="features-benefits-value">The WR06 series resistors from Walsin are general purpose thick film chip resistors. These resistors are constructed in a high grade ceramic body (aluminium oxide).</span></div><div class="features-and-benefits-list"><ul class="features-and-benefits-list-list"><li class="features-and-benefits-list-item">Resistance range includes E24 and E96 decade values from 1ohm to 10Mohm</li><li class="features-and-benefits-list-item">EIA 0603 case size</li><li class="features-and-benefits-list-item">Available in ?±100ppm/°C and -200ppm/°C to +400ppm/°C TCR values</li><li class="features-and-benefits-list-item">Available in ±1% and ±5% tolerance</li><li class="features-and-benefits-list-item">High reliability and stability</li><li class="features-and-benefits-list-item">Higher component and equipment reliability</li><li class="features-and-benefits-list-item">Lower assembly costs</li><li class="features-and-benefits-list-item">Reduced size of final equipment</li><li class="features-and-benefits-list-item">Continuous working voltage is 75V and rated power is 100; ComponentLink1URL: http://www.farnell.com/datasheets/1960319.pdf; ComponentLink1Description: http://www.farnell.com/datasheets/1960319.pdf
R69 = RC0603FR-0710KL: YAGEO (PHYCOMP) - RC0603FR-0710KL - RES, THICK FILM, 10K, 1%, 0.1W, 0603; Voltage Rating: 50; Resistor Case Style: 0603 [1608 Metric]; Power Rating: 100; Product Range: RC Series; Temperature Coefficient: ± 100; SVHC: No SVHC (20-Jun-2016); Manufacturer: YAGEO (PHYCOMP); Manufacturer Part Number: RC0603FR-0710KL; RoHS: YES; Stock 1: 9995; Pricing 1: 5000=0.0025, 25000=0.0014, 50000=0.0013 (GBP); Resistance: 10k; Resistance Tolerance: ± 1%; Packaging: Tape & Reel; Resistor Element Material: Thick Film; Automotive Qualification Standard: -; MSL: MSL 1 - Unlimited<!--FANDB--><div class="features-and-benefits-container"><div class="features-and-benefits-desc-container"><span class="features-and-benefits-container-desc">SMD Chip Resistor, Thick Film, 10 kohm, 50 V, 0603 [1608 Metric], 100 mW, ± 1; ComponentLink1URL: http://past.yageo.com/pdf/PYu-R_Packing_6.pdf; ComponentLink1Description: http://past.yageo.com/pdf/PYu-R_Packing_6.pdf; ComponentLink2URL: http://www.farnell.com/datasheets/2167052.pdf; ComponentLink2Description: http://www.farnell.com/datasheets/2167052.pdf; Supplier 1: Mouser; Supplier Part Number 1: 603-RC0603FR-0710KL; Supplier 2: Farnell; Supplier Part Number 2: 2421850; Supplier 3: Digi-Key; Supplier Part Number 3: 311-10.0KHRCT-ND
U22 = LMX2572LPRHAT: 2-GHz Low Power Wideband RF Synthesizer With FSK Modulation 40-VQFN -40 to 85; Manufacturer: Texas Instruments; PLL: Yes; Input: Clock; Number of Circuits: 1; Max Frequency: 2GHz; Supplier 1: Mouser; Supplier Part Number 1: 595-LMX2572LPRHAT; Manufacturer Part Number: LMX2572LPRHAT; RoHS: Yes; Category: Clock Generators, PLLs, Frequency Synthesizers; Stock 1: 77; Pricing 1: 1=14.10000, 10=12.96000, 50=12.43000, 100=10.95000, 1000=10.40000, 10000=10.40000 (USD); Mount: Surface Mount; Case/Package: VQFN; Min Operating Temperature: -40°C; Max Operating Temperature: 85°C; Packaging: Tape and Reel; RoHS Compliant: Yes; ComponentLink1URL: http://www.ti.com/general/docs/suppproductinfo.tsp?distId=10&amp;gotoUrl=http%3A%2F%2Fwww.ti.com%2Flit%2Fgpn%2Flmx2572lp&src-supplier=Digi-Key; ComponentLink1Description: http://www.ti.com/general/docs/suppproductinfo.tsp?distId=10&amp;gotoUrl=http%3A%2F%2Fwww.ti.com%2Flit%2Fgpn%2Flmx2572lp&src-supplier=Digi-Key; ComponentLink2URL: http://www.ti.com/lit/ds/symlink/lmx2572lp.pdf?src-supplier=Digi-Key; ComponentLink2Description: http://www.ti.com/lit/ds/symlink/lmx2572lp.pdf?src-supplier=Digi-Key; Supplier 2: Arrow Electronics; Supplier Part Number 2: LMX2572LPRHAT; Supplier 3: Digi-Key; Supplier Part Number 3: 296-51375-1-ND
U23 U25 = B39461B5058Z810: SAW Filter 460MHzFrequency 50Ohm SMD 8Pin QCC8B; Manufacturer: RF360 Holdings; Supplier 1: Mouser; Supplier Part Number 1: 871-B39461B5058Z810; Manufacturer Part Number: B39461B5058Z810; RoHS: No; Category: EMI / RFI Components; Stock 1: 2625; Pricing 1: 1=2.87000, 10=2.77000, 50=2.77000, 100=1.77000, 1000=1.46000, 10000=1.19000 (USD)
U24 = PAT1220-C-8DB-T5: Chip Attenuator 10GHz 8dB, 100mW; Manufacturer: Susumu; Impedance: 50R; Supplier 1: Mouser; Supplier Part Number 1: 754-PAT1220C-8DBT5; Manufacturer Part Number: PAT1220-C-8DB-T5; RoHS: Yes; Category: Uncategorized; Stock 1: 9090; Pricing 1: 1=0.35000, 10=0.30800, 25=0.27800, 100=0.24300, 250=0.21300, 500=0.18800 (USD); Case/Package: 0805; Number of Pins: 3; Case Code (Imperial): 0805; Case Code (Metric): 2012; Max Power Dissipation: 100mW; Package Quantity: 1; Attenuation Value: 8dB; Packaging: Tape and Reel; Lead Free: Lead Free; ComponentLink1URL: https://datasheet.ciiva.com/17406/products-38-17406604.pdf?src-supplier=Future+Electronics; ComponentLink1Description: https://datasheet.ciiva.com/17406/products-38-17406604.pdf?src-supplier=Future+Electronics; ComponentLink2URL: https://datasheet.ciiva.com/2788/products-38-2788461.pdf?src-supplier=Digi-Key; ComponentLink2Description: https://datasheet.ciiva.com/2788/products-38-2788461.pdf?src-supplier=Digi-Key; ComponentLink3URL: https://datasheet.ciiva.com/2788/products-38-2788462.pdf?src-supplier=Digi-Key; ComponentLink3Description: https://datasheet.ciiva.com/2788/products-38-2788462.pdf?src-supplier=Digi-Key; ComponentLink4URL: https://datasheet.ciiva.com/2788/products-38-2788463.pdf?src-supplier=Digi-Key; ComponentLink4Description: https://datasheet.ciiva.com/2788/products-38-2788463.pdf?src-supplier=Digi-Key
U26 = SKY65017-70LF: IC AMP INGAP LF-6GHZ SOT-89; Manufacturer: Skyworks Solutions Inc.; Frequency: 0.1Hz ~ 6GHz; P1dB: 20dBm (100mW); Gain: 20dB; Noise Figure: 5dB; RF Type: DBS, HLAN, WLAN; Voltage - Supply: 4.5 V ~ 5.5 V; Current - Supply: 120mA; Test Frequency: 2GHz; Manufacturer Part Number: SKY65017-70LF; RoHS: RoHS Compliant; Category: RF/IF and RFID; Stock 1: 6721; Pricing 1: 1=3, 10=2.683, 25=2.4144, 100=2.1999, 250=1.98524, 500=1.78134 (USD); Packaging: Cut Tape (CT); Part Status: Active; Package / Case: TO-243AA; Supplier Device Package: SOT-89-3; ComponentLink1URL: http://www.skyworksinc.com/uploads/documents/SKY65017_70LF_200528G.pdf; ComponentLink1Description: http://www.skyworksinc.com/uploads/documents/SKY65017_70LF_200528G.pdf; Supplier 1: Mouser; Supplier Part Number 1: 873-SKY65017-70LF; Supplier 2: Digi-Key; Supplier Part Number 2: 863-1063-1-ND